# EAGLE schematic pcb1a (EAGLE 9.6.2)
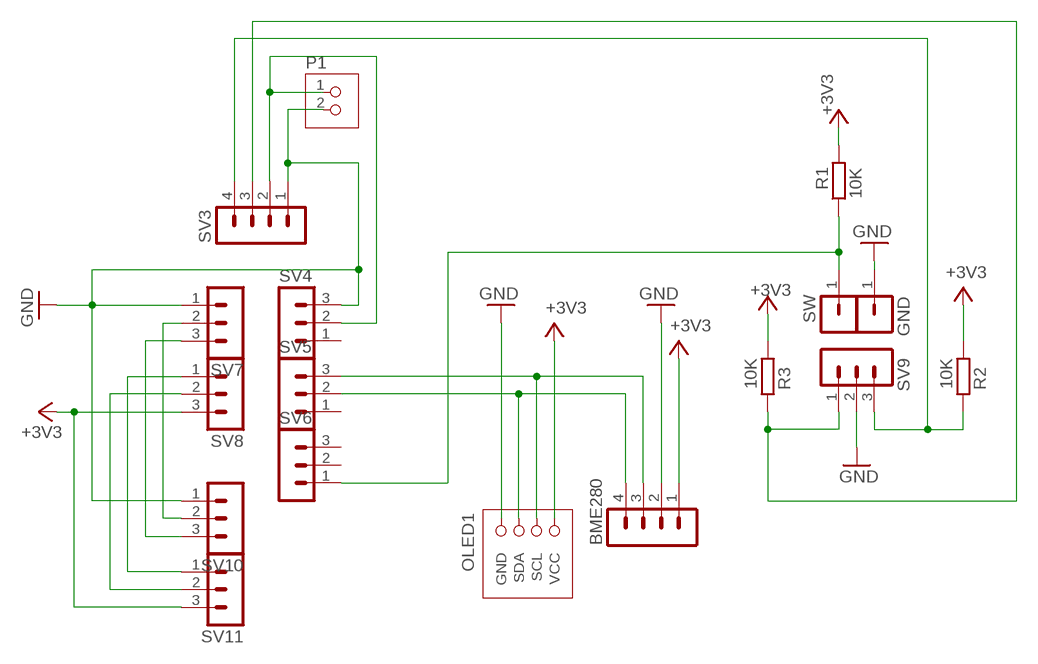
[diagram p0: schematic, sheet 1]

## Parts
BME280  PINHEAD-MA04-1  [PINHEAD-MA04-1]
GND  PINHEAD-MA01-1  [PINHEAD-MA01-1]
OLED1  OLED-SSD1306-0.96  [OLED-I2C-0.96]
P1  JST-PH2  [JST-PH2]
R1  10K  R-EU_0204/5  [0204/5]
R2  10K  R-EU_0204/5  [0204/5]
R3  10K  R-EU_0204/5  [0204/5]
SV3  PINHEAD-MA04-1  [PINHEAD-MA04-1]
SV4  PINHEAD-MA03-1  [PINHEAD-MA03-1]
SV5  PINHEAD-MA03-1  [PINHEAD-MA03-1]
SV6  PINHEAD-MA03-1  [PINHEAD-MA03-1]
SV7  PINHEAD-MA03-1  [PINHEAD-MA03-1]
SV8  PINHEAD-MA03-1  [PINHEAD-MA03-1]
SV9  PINHEAD-MA03-1  [PINHEAD-MA03-1]
SV10  PINHEAD-MA03-1  [PINHEAD-MA03-1]
SV11  PINHEAD-MA03-1  [PINHEAD-MA03-1]
SW  PINHEAD-MA01-1  [PINHEAD-MA01-1]

## Nets
+3V3: BME280.1 OLED1.VCC R1.2 R2.1 R3.1 SV8.3 SV11.3
GND: BME280.2 GND.1 OLED1.GND P1.2 SV3.1 SV4.3 SV7.1 SV9.2 SV10.1
N$1: R3.2 SV3.3 SV9.1
N$2: BME280.3 OLED1.SCL SV5.3
N$3: BME280.4 OLED1.SDA SV5.2
N$4: SV7.2 SV10.2
N$5: P1.1 SV3.2 SV4.2
N$6: R2.2 SV3.4 SV9.3
N$7: SV7.3 SV10.3
N$8: SV8.1 SV11.1
N$9: SV8.2 SV11.2
N$10: R1.1 SV6.1 SW.1
Unconnected: SV4.1 SV5.1 SV6.2 SV6.3

## Library data of the parts
BME280 SV3 = ytani1:PINHEAD-MA04-1: PIN HEADER; OC_FARNELL: unknown; OC_NEWARK: unknown
GND SW = ytani1:PINHEAD-MA01-1
OLED1 = ytani1:OLED-SSD1306-0.96: OLED SSD1306 0.96inch 128x96 I2C https://akizukidenshi.com/catalog/g/gP-12031/ Vcc: 3V-5.5V I2C addr: 0x3C Control chip: SSD1306 Blank/White; OC_AKIZUKI: P-12031; URL_AKIZUKI: https://akizukidenshi.com/catalog/g/gP-12031/
P1 = ytani1:JST-PH2
R1-R3 = rcl:R-EU_: RESISTOR, European symbol; SPICEPREFIX: R
SV4-SV11 = ytani1:PINHEAD-MA03-1: PIN HEADER; OC_FARNELL: unknown; OC_NEWARK: unknown